# EAGLE schematic circuito (EAGLE 7.4.0)
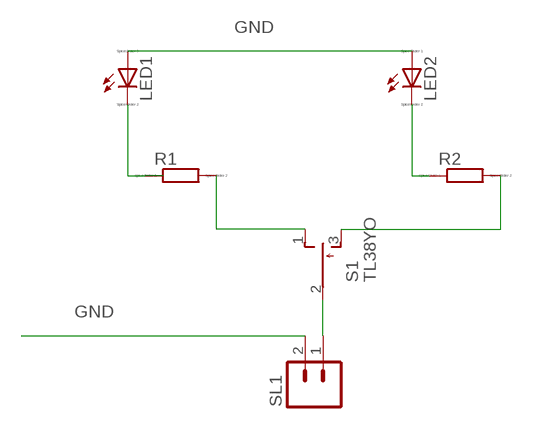
[diagram p0: schematic, sheet 1]

## Parts
LED1  LED_ELD260  [LED_LD260]
LED2  LED_ELD260  [LED_LD260]
R1  R0204/7  [0204/7]
R2  R0204/7  [0204/7]
S1  TL38YO  [TL3XYO]
SL1  M02  [02P]

## Nets
GND: LED1.A LED2.A SL1.2
N$1: LED1.K(C) R1.1
N$2: R2.2 S1.3(S)
N$4: S1.2(P) SL1.1
N$6: LED2.K(C) R2.1
N$7: R1.2 S1.1(O)

## Library data of the parts
LED1 LED2 = eagle-ltspice:LED_E: LED Source: http://www.osram.convergy.de Source: www.luxeon.com Source: www.kingbright.com; SPICEMODEL: NONE; SPICEPREFIX: D; SPICETYPE: diode
R1 R2 = eagle-ltspice:R: RESISTOR, European symbol; SPICEMODEL: NONE; SPICEPREFIX: R
S1 = switch:TL38YO: TINY SWITCH ON OFF MOM Source: http://www2.produktinfo.conrad.com/datenblaetter/700000-724999/705152-da-01-de-Subminiaturschalter_TL_36YO.pdf
SL1 = con-amp-quick:M02: AMP QUICK CONNECTOR; OC_FARNELL: unknown; OC_NEWARK: unknown